# Altium schematic sheet ESP32.SchDoc
size A; DocumentNumber: 2; SheetNumber: 2; SheetTotal: 6
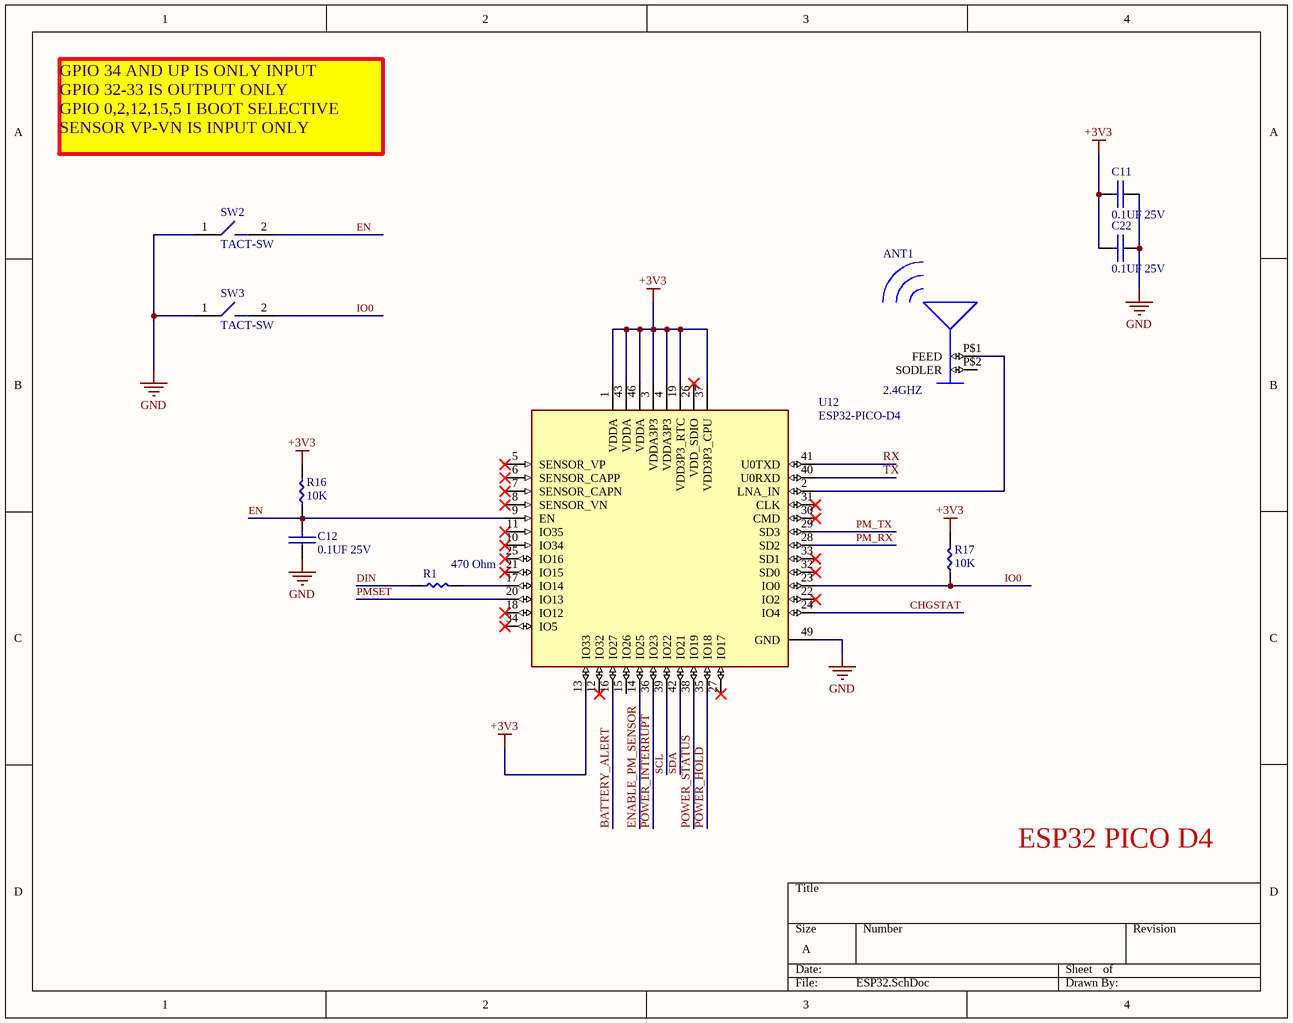
[diagram p0: ESP32.SchDoc]

## Parts
ANT1  2.4GHZ  [AN2051]
C11  0.1UF 25V  [C0603]
C12  0.1UF 25V  [C0603]
C22  0.1UF 25V  [C0603]
R1  470 Ohm  [R0603]
R16  10K  [R0603]
R17  10K  [R0603]
SW2  TACT-SW  [kmr7-switch]
SW3  TACT-SW  [kmr7-switch]
U12  ESP32-PICO-D4  [PQFN50P700X700X104-49N]

## Nets
+3V3: C11.2 C22.2 R16.2 R17.2 U12.1(VDDA) U12.3(VDDA3P3) U12.4(VDDA3P3) U12.13(IO33) U12.19(VDD3P3_RTC) U12.37(VDD3P3_CPU) U12.43(VDDA) U12.46(VDDA)
GND: C11.1 C12.1 C22.1 SW2.1 SW3.1 U12.49(GND)
BATTERY_ALERT: U12.16(IO27)
CHGSTAT: U12.24(IO4)
DIN: R1.1
EN: C12.2 R16.1 SW2.2 U12.9(EN)
ENABLE_PM_SENSOR: U12.14(IO25)
IO0: R17.1 SW3.2 U12.23(IO0)
PM_RX: U12.28(SD2)
PM_TX: U12.29(SD3)
PMSET: U12.20(IO13)
POWER_HOLD: U12.35(IO18)
POWER_INTERRUPT: U12.36(IO23)
POWER_STATUS: U12.38(IO19)
RX: U12.41(U0TXD)
SCL: U12.39(IO22)
SDA: U12.42(IO21)
TX: U12.40(U0RXD)
NetANT1_P$1: ANT1.P$1(FEED) U12.2(LNA_IN)
NetR1_2: R1.2 U12.17(IO14)

Not connected (* = marked no-connect by the designer): ANT1 P$2(SODLER); U12 5(SENSOR_VP)* 6(SENSOR_CAPP)* 7(SENSOR_CAPN)* 8(SENSOR_VN)* 10(IO34)* 11(IO35)* 12(IO32)* 15(IO26) 18(IO12)* 21(IO15)* 22(IO2)* 25(IO16)* 26(VDD_SDIO)* 27(IO17)* 30(CMD)* 31(CLK)* 32(SD0)* 33(SD1)* 34(IO5)*

## Notes on the sheet
- GPIO 34 AND UP IS ONLY INPUT
  GPIO 32-33 IS OUTPUT ONLY
  GPIO 0,2,12,15,5 I BOOT SELECTIVE
  SENSOR VP-VN IS INPUT ONLY
- ESP32 PICO D4

## Library data of the parts
ANT1 = AN2051: SMD Built-in Antenna 2.4GHz; MF: RainSun; Package: None; Value: *; Price: None; MP: AN2051; Availability: Unavailable; SnapEDA_Link: https://www.snapeda.com/parts/AN2051/RainSun/view-part/550460/?ref=snap
C11 C12 C22 = 06033D104KAT2A: CAP CER 0.1UF 25V X5R 0603; Manufacturer: Kyocera AVX; Capacitance: 100 nF; Tolerance (%): ±10 %; Supplier 1: Digi-Key; Manufacturer Part Number: 06033D104KAT2A; Stock 1: 0; Pricing 1: 1=0.32, 10=0.221, 100=0.1328, 500=0.0996, 1000=0.0841 (USD); Case Size/Dimension: 0603; Dielectric: X5R; Rated Voltage: 25 V; ComponentLink1URL: https://datasheet.ciiva.com/19475/1031061-19475906.pdf; ComponentLink1Description: https://datasheet.ciiva.com/19475/1031061-19475906.pdf; ComponentLink2URL: https://datasheet.ciiva.com/28613/759405-28613274.pdf; ComponentLink2Description: https://datasheet.ciiva.com/28613/759405-28613274.pdf; ComponentLink3URL: https://datasheet.ciiva.com/16397/cx5r-16397162.pdf; ComponentLink3Description: https://datasheet.ciiva.com/16397/cx5r-16397162.pdf; ComponentLink4URL: https://datasheet.ciiva.com/28613/1666675-28613037.pdf; ComponentLink4Description: https://datasheet.ciiva.com/28613/1666675-28613037.pdf; ComponentLink5URL: https://datasheet.ciiva.com/28613/1666675-28613275.pdf; ComponentLink5Description: https://datasheet.ciiva.com/28613/1666675-28613275.pdf; ComponentLink6URL: https://datasheet.ciiva.com/152/cx5r-152227.pdf; ComponentLink6Description: https://datasheet.ciiva.com/152/cx5r-152227.pdf; ComponentLink7URL: https://datasheet.ciiva.com/152/cx5r-152226.pdf; ComponentLink7Description: https://datasheet.ciiva.com/152/cx5r-152226.pdf; ComponentLink8URL: https://datasheet.ciiva.com/2987/cx5r-2987761.pdf; ComponentLink8Description: https://datasheet.ciiva.com/2987/cx5r-2987761.pdf; ComponentLink9URL: https://datasheet.ciiva.com/152/cx5r-152225.pdf; ComponentLink9Description: https://datasheet.ciiva.com/152/cx5r-152225.pdf; ComponentLink10URL: https://datasheet.ciiva.com/2987/cx5r-2987762.pdf; ComponentLink10Description: https://datasheet.ciiva.com/2987/cx5r-2987762.pdf; Supplier Part Number 1: 478-1244-6-ND
R1 = CRCW0603-470RFKEA: SMD Resistor, Thick film 470 Ohm,  ±  1 %, 0603, CRCW0603470RFKEA, Vishay; Brand: Vishay / Dale; Resistance: 470 Ohms; Tolerance: 1 %; Power Rating: 100 mW; Temperature Coefficient: 100 PPM / K; Voltage Rating: 75 V; Unit Weight: 0.000071 oz; Supplier 1: Digi-Key; Manufacturer: Vishay; Manufacturer Part Number: CRCW0603-470RFKEA; Stock 1: 0; Product Category: Thick Film Resistors - SMD; RoHS: Details; Case Code - in: 0603; Case Code - mm: 1608; Operating Temperature Range: - 55 C to + 155 C; Series: CRCW; Height: 0.45 mm; Length: 1.55 mm; Package / Case: 0603 (1608 metric); Packaging: Reel; Product: Thick Film Resistors SMD; Factory Pack Quantity: 5000; Termination Style: SMD/SMT; Width: 0.85 mm; ComponentLink1URL: http://www.vishay.com/docs/20035/dcrcwe3.pdf?src-supplier=Digi-Key; ComponentLink1Description: http://www.vishay.com/docs/20035/dcrcwe3.pdf?src-supplier=Digi-Key; ComponentLink2URL: http://uk.rs-online.com/webdocs/13ec/0900766b813ecbec.pdf?src-supplier=RSComponents; ComponentLink2Description: http://uk.rs-online.com/webdocs/13ec/0900766b813ecbec.pdf?src-supplier=RSComponents; ComponentLink3URL: https://www.verical.com/server-webapp/html/getDatasheet?partID=45798&src-supplier=Verical; ComponentLink3Description: https://www.verical.com/server-webapp/html/getDatasheet?partID=45798&src-supplier=Verical; ComponentLink4URL: http://www.vishay.com/docs/20008/dcrcw.pdf?src-supplier=Avnet+Europe; ComponentLink4Description: http://www.vishay.com/docs/20008/dcrcw.pdf?src-supplier=Avnet+Europe; ComponentLink5URL: http://www.vishay.com/docs/20035/dcrcwe3.pdf?src-supplier=Avnet; ComponentLink5Description: http://www.vishay.com/docs/20035/dcrcwe3.pdf?src-supplier=Avnet; ComponentLink6URL: http://www.mouser.com/ds/2/427/dcrcwe3-109170.pdf?src-supplier=Mouser; ComponentLink6Description: http://www.mouser.com/ds/2/427/dcrcwe3-109170.pdf?src-supplier=Mouser; ComponentLink7URL: http://www.farnell.com/datasheets/2310790.pdf?src-supplier=Element14; ComponentLink7Description: http://www.farnell.com/datasheets/2310790.pdf?src-supplier=Element14; ComponentLink8URL: http://www.farnell.com/datasheets/2045673.pdf?src-supplier=Element14; ComponentLink8Description: http://www.farnell.com/datasheets/2045673.pdf?src-supplier=Element14; ComponentLink9URL: https://www.distrelec.biz/Web/Downloads/a_/en/flD-CRCW-e3_data_en.pdf?mime=application%2Fpdf&src-supplier=Distrelec; ComponentLink9Description: https://www.distrelec.biz/Web/Downloads/a_/en/flD-CRCW-e3_data_en.pdf?mime=application%2Fpdf&src-supplier=Distrelec; Supplier Part Number 1: 541-470HTR-ND
R16 R17 = RC0603FR-0710KL: RES SMD 10K OHM 1% 1/10W 0603; Manufacturer: Yageo; Power (Watts): 0.1W, 1/10W; Temperature Coefficient: ±100ppm/°C; Supplier 1: Digi-Key; Manufacturer Part Number: RC0603FR-0710KL; RoHS: RoHS Compliant; Category: Resistors; Stock 1: 5916612; Pricing 1: 1=0.1, 10=0.015, 100=0.006, 1000=0.00268, 2500=0.00233 (USD); Packaging: Digi-Reel®; Part Status: Active; Tolerance: ±1%; Composition: Thick Film; Features: Moisture Resistant; Operating Temperature: -55°C ~ 155°C; Package / Case: 0603 (1608 Metric); Supplier Device Package: 0603; Size / Dimension: 0.063" L x 0.032" W (1.60mm x 0.80mm); Height - Seated (Max): 0.022" (0.55mm); Failure Rate: -; ComponentLink1URL: http://www.yageo.com/documents/recent/PYu-RC_Group_51_RoHS_L_8.pdf; ComponentLink1Description: http://www.yageo.com/documents/recent/PYu-RC_Group_51_RoHS_L_8.pdf; Supplier Part Number 1: 311-10.0KHRDKR-ND
SW2 SW3 = KMR731NGLFS: switch; Manufacturer: ITT C&K; Circuit: SPST-NO; Switch Function: Off-Mom; Contact Rating @ Voltage: 0.05A @ 32VDC; Actuator Type: Standard; Actuator Height off PCB, from Pins: 2.50mm; Actuator Orientation: Top Actuated; Outline: 4.20mm x 2.80mm; Illumination: Non-Illuminated; Operating Force: 300gf; Ingress Protection: IP67 - Dust Tight, Waterproof; Mechanical Life: 150,000 Cycles; Supplier 1: Mouser; Manufacturer Part Number: KMR731NGLFS; Stock 1: 5277; Pricing 1: 1=0.34, 10=0.333, 50=0.309, 100=0.298, 1000=0.203, 10000=0.167 (USD); Category: Switches; Family: Tactile Switches; Series: KMR7; Packaging: Tape & Reel (TR); Mounting Type: Surface Mount; Termination Style: Gull Wing; Illumination Voltage (Nominal): -; Illumination Type, Color: -; Features: -; Actuator Material: -; Switch Travel: -; Operating Temperature: -40°C ~ 85°C; Supplier Part Number 1: 611-KMR731NGLFS
U12 = ESP32-PICO-D4: Bluetooth, WiFi 802.11b/g/n, Bluetooth v4.2 + EDR, Class 1, 2 and 3 Transceiver Module 2.4GHz ~ 2.5GHz Surface Mount; MF: Espressif Systems; Package: SMD-48 Espressif Systems; Price: None; Availability: Unavailable; MP: ESP32-PICO-D4; SnapEDA_Link: https://www.snapeda.com/parts/ESP32-PICO-D4/Espressif%20Systems/view-part/2762121/?ref=snap; Value: *